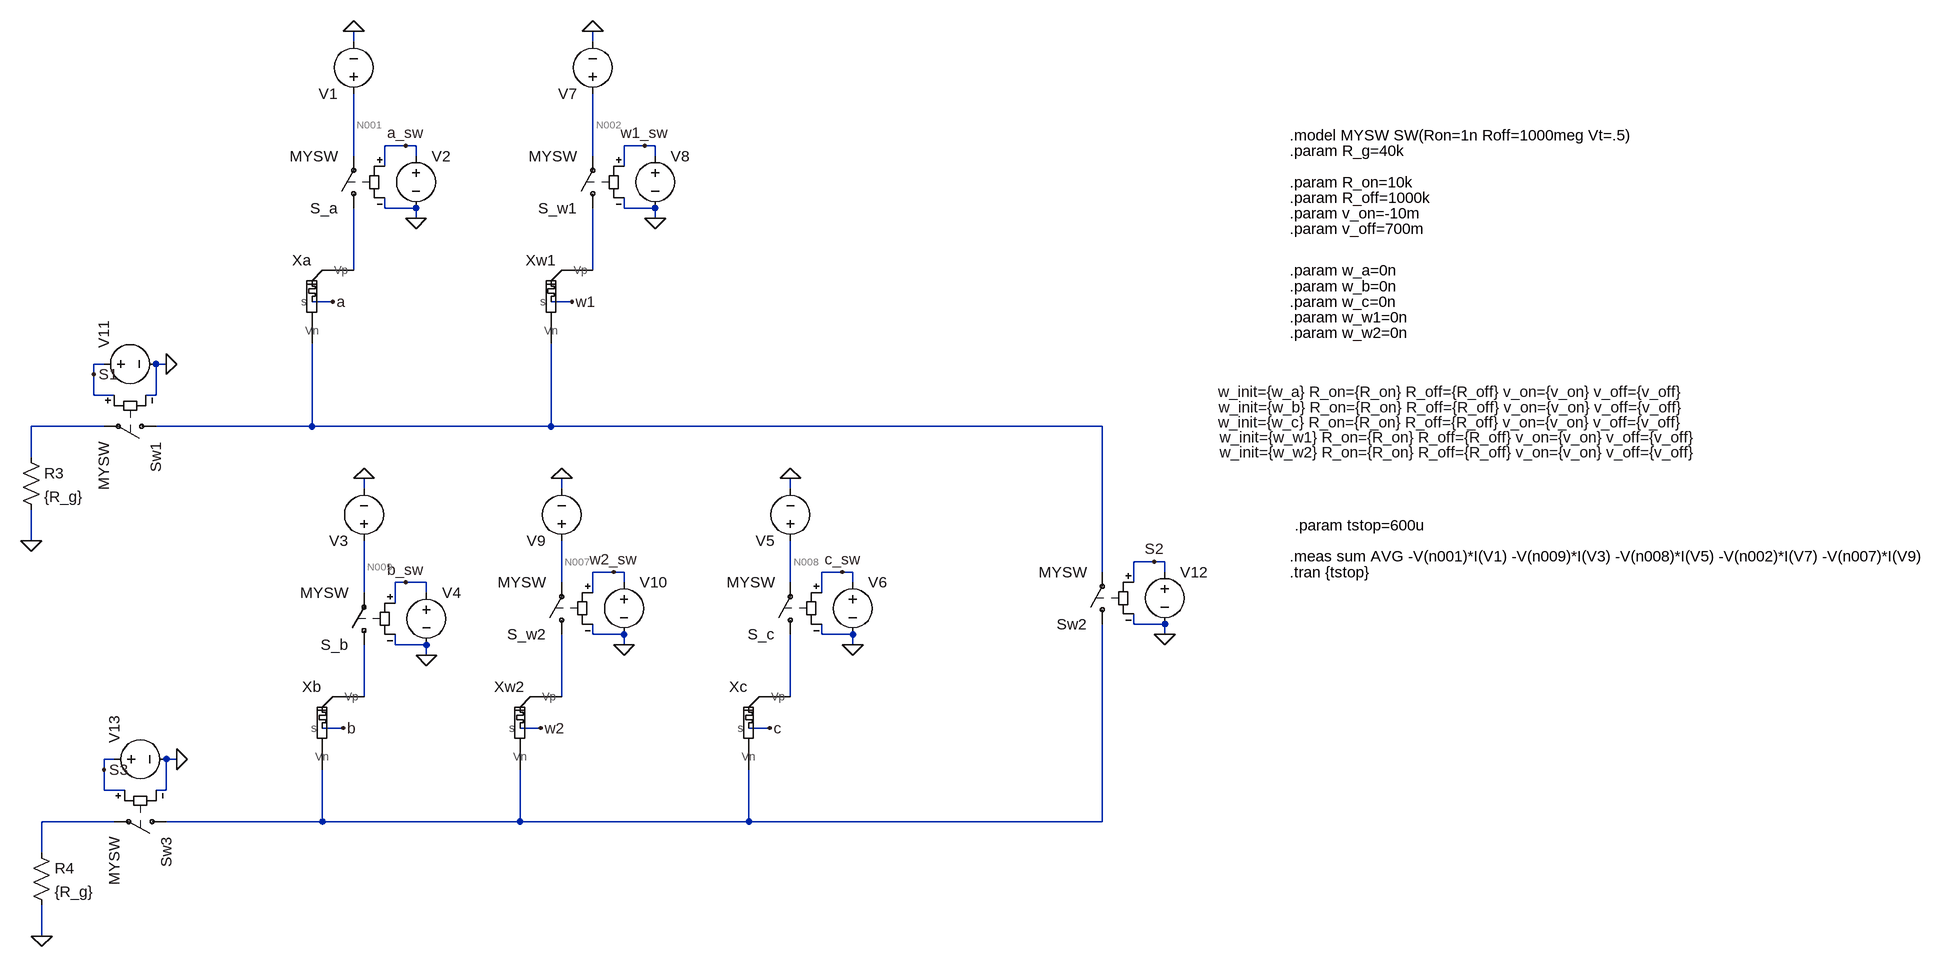
[diagram p0: schematic 1bit_adder_cin.asc]
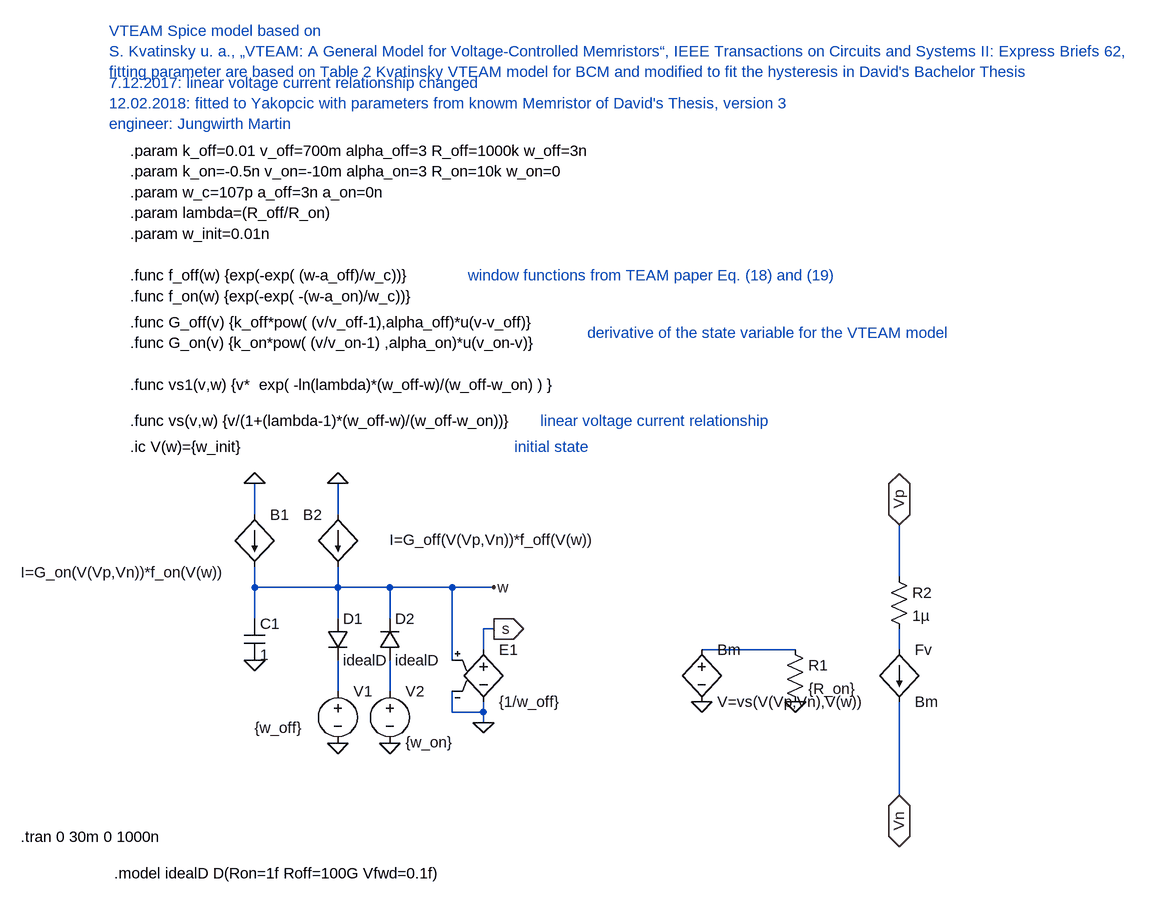
[diagram p1: sub-circuit vteam_knowm.asc]
1bit_adder_cin.asc, the LTspice schematic file:
Version 4
SHEET 1 2472 1840
WIRE -1360 144 -1360 128
WIRE -992 144 -992 128
WIRE -1280 304 -1312 304
WIRE -1264 304 -1280 304
WIRE -912 304 -944 304
WIRE -896 304 -912 304
WIRE -1360 320 -1360 224
WIRE -1264 320 -1264 304
WIRE -992 320 -992 224
WIRE -896 320 -896 304
WIRE -1312 336 -1312 304
WIRE -944 336 -944 304
WIRE -1312 400 -1312 384
WIRE -1264 400 -1312 400
WIRE -944 400 -944 384
WIRE -896 400 -944 400
WIRE -1264 416 -1264 400
WIRE -896 416 -896 400
WIRE -1360 496 -1360 400
WIRE -992 496 -992 400
WIRE -1392 544 -1424 544
WIRE -1024 544 -1056 544
WIRE -1744 640 -1760 640
WIRE -1648 640 -1664 640
WIRE -1760 656 -1760 640
WIRE -1760 688 -1760 656
WIRE -1728 688 -1760 688
WIRE -1664 688 -1664 640
WIRE -1664 688 -1680 688
WIRE -1744 736 -1856 736
WIRE -1424 736 -1424 608
WIRE -1424 736 -1664 736
WIRE -1056 736 -1056 608
WIRE -1056 736 -1424 736
WIRE -208 736 -1056 736
WIRE -1856 784 -1856 736
WIRE -1344 832 -1344 816
WIRE -1040 832 -1040 816
WIRE -688 832 -688 816
WIRE -1856 912 -1856 864
WIRE -128 944 -160 944
WIRE -112 944 -128 944
WIRE -960 960 -992 960
WIRE -944 960 -960 960
WIRE -608 960 -640 960
WIRE -592 960 -608 960
WIRE -208 960 -208 736
WIRE -112 960 -112 944
WIRE -1280 976 -1296 976
WIRE -1248 976 -1280 976
WIRE -1040 976 -1040 912
WIRE -944 976 -944 960
WIRE -688 976 -688 912
WIRE -592 976 -592 960
WIRE -160 976 -160 944
WIRE -1344 992 -1344 912
WIRE -1248 992 -1248 976
WIRE -992 992 -992 960
WIRE -640 992 -640 960
WIRE -1296 1008 -1296 976
WIRE -160 1040 -160 1024
WIRE -112 1040 -160 1040
WIRE -992 1056 -992 1040
WIRE -944 1056 -992 1056
WIRE -640 1056 -640 1040
WIRE -592 1056 -640 1056
WIRE -112 1056 -112 1040
WIRE -1296 1072 -1296 1056
WIRE -1248 1072 -1296 1072
WIRE -944 1072 -944 1056
WIRE -592 1072 -592 1056
WIRE -1248 1088 -1248 1072
WIRE -1344 1152 -1344 1072
WIRE -1040 1152 -1040 1056
WIRE -688 1152 -688 1056
WIRE -1376 1200 -1408 1200
WIRE -1072 1200 -1104 1200
WIRE -720 1200 -752 1200
WIRE -1728 1248 -1744 1248
WIRE -1632 1248 -1648 1248
WIRE -1744 1264 -1744 1248
WIRE -1744 1296 -1744 1264
WIRE -1712 1296 -1744 1296
WIRE -1648 1296 -1648 1248
WIRE -1648 1296 -1664 1296
WIRE -1728 1344 -1840 1344
WIRE -1408 1344 -1408 1264
WIRE -1408 1344 -1648 1344
WIRE -1104 1344 -1104 1264
WIRE -1104 1344 -1408 1344
WIRE -752 1344 -752 1264
WIRE -752 1344 -1104 1344
WIRE -208 1344 -208 1040
WIRE -208 1344 -752 1344
WIRE -1840 1392 -1840 1344
WIRE -1840 1520 -1840 1472
FLAG -1360 128 0
FLAG -1344 816 0
FLAG -1264 416 0
FLAG -1248 1088 0
FLAG -1392 544 a
FLAG -1376 1200 b
FLAG -1280 304 a_sw
FLAG -1280 976 b_sw
FLAG -1856 912 0
FLAG -1840 1520 0
FLAG -1648 640 0
FLAG -1760 656 S1
FLAG -1632 1248 0
FLAG -1744 1264 S3
FLAG -112 1056 0
FLAG -128 944 S2
FLAG -992 128 0
FLAG -896 416 0
FLAG -1024 544 w1
FLAG -912 304 w1_sw
FLAG -1040 816 0
FLAG -944 1072 0
FLAG -1072 1200 w2
FLAG -960 960 w2_sw
FLAG -688 816 0
FLAG -592 1072 0
FLAG -720 1200 c
FLAG -608 960 c_sw
SYMBOL voltage -1360 240 R180
WINDOW 3 24 96 Invisible 2
WINDOW 123 0 0 Left 2
WINDOW 39 0 0 Left 2
SYMATTR Value PWL file=a.csv
SYMATTR InstName V1
SYMBOL voltage -1344 928 R180
WINDOW 3 24 96 Invisible 2
WINDOW 123 0 0 Left 2
WINDOW 39 0 0 Left 2
SYMATTR Value PWL file=b.csv
SYMATTR InstName V3
SYMBOL sw -1360 416 R180
SYMATTR InstName S_a
SYMATTR Value MYSW
SYMBOL voltage -1264 304 R0
WINDOW 3 24 96 Invisible 2
WINDOW 123 0 0 Left 2
WINDOW 39 0 0 Left 2
SYMATTR Value PWL file=a_sw.csv
SYMATTR InstName V2
SYMBOL sw -1344 1088 R180
SYMATTR InstName S_b
SYMATTR Value MYSW
SYMBOL voltage -1248 976 R0
WINDOW 3 24 96 Invisible 2
WINDOW 123 0 0 Left 2
WINDOW 39 0 0 Left 2
SYMATTR Value PWL file=b_sw.csv
SYMATTR InstName V4
SYMBOL VTEAM_knowm -1472 496 R0
WINDOW 39 1806 202 Bottom 2
SYMATTR SpiceLine w_init={w_a} R_on={R_on} R_off={R_off} v_on={v_on} v_off={v_off}
SYMATTR InstName Xa
SYMBOL VTEAM_knowm -1456 1152 R0
WINDOW 39 1791 -430 Bottom 2
SYMATTR SpiceLine w_init={w_b} R_on={R_on} R_off={R_off} v_on={v_on} v_off={v_off}
SYMATTR InstName Xb
SYMBOL res -1872 768 R0
SYMATTR InstName R3
SYMATTR Value {R_g}
SYMBOL res -1856 1376 R0
SYMATTR InstName R4
SYMATTR Value {R_g}
SYMBOL sw -1648 736 R90
SYMATTR InstName Sw1
SYMATTR Value MYSW
SYMBOL voltage -1760 640 R270
WINDOW 3 24 96 Invisible 2
WINDOW 123 0 0 Left 2
WINDOW 39 0 0 Left 2
SYMATTR Value PWL file=S1.csv
SYMATTR InstName V11
SYMBOL sw -1632 1344 R90
SYMATTR InstName Sw3
SYMATTR Value MYSW
SYMBOL voltage -1744 1248 R270
WINDOW 3 24 96 Invisible 2
WINDOW 123 0 0 Left 2
WINDOW 39 0 0 Left 2
SYMATTR Value PWL file=S3.csv
SYMATTR InstName V13
SYMBOL sw -208 1056 R180
SYMATTR InstName Sw2
SYMATTR Value MYSW
SYMBOL voltage -112 944 R0
WINDOW 3 24 96 Invisible 2
WINDOW 123 0 0 Left 2
WINDOW 39 0 0 Left 2
SYMATTR Value PWL file=S2.csv
SYMATTR InstName V12
SYMBOL voltage -992 240 R180
WINDOW 3 24 96 Invisible 2
WINDOW 123 0 0 Left 2
WINDOW 39 0 0 Left 2
SYMATTR Value PWL file=w1.csv
SYMATTR InstName V7
SYMBOL sw -992 416 R180
SYMATTR InstName S_w1
SYMATTR Value MYSW
SYMBOL voltage -896 304 R0
WINDOW 3 24 96 Invisible 2
WINDOW 123 0 0 Left 2
WINDOW 39 0 0 Left 2
SYMATTR Value PWL file=w1_sw.csv
SYMATTR InstName V8
SYMBOL VTEAM_knowm -1104 496 R0
WINDOW 39 1449 272 Bottom 2
SYMATTR SpiceLine w_init={w_w1} R_on={R_on} R_off={R_off} v_on={v_on} v_off={v_off}
SYMATTR InstName Xw1
SYMBOL voltage -1040 928 R180
WINDOW 3 24 96 Invisible 2
WINDOW 123 0 0 Left 2
WINDOW 39 0 0 Left 2
SYMATTR Value PWL file=w2.csv
SYMATTR InstName V9
SYMBOL sw -1040 1072 R180
SYMATTR InstName S_w2
SYMATTR Value MYSW
SYMBOL voltage -944 960 R0
WINDOW 3 24 96 Invisible 2
WINDOW 123 0 0 Left 2
WINDOW 39 0 0 Left 2
SYMATTR Value PWL file=w2_sw.csv
SYMATTR InstName V10
SYMBOL VTEAM_knowm -1152 1152 R0
WINDOW 39 1497 -361 Bottom 2
SYMATTR SpiceLine w_init={w_w2} R_on={R_on} R_off={R_off} v_on={v_on} v_off={v_off}
SYMATTR InstName Xw2
SYMBOL voltage -688 928 R180
WINDOW 3 24 96 Invisible 2
WINDOW 123 0 0 Left 2
WINDOW 39 0 0 Left 2
SYMATTR Value PWL file=c.csv
SYMATTR InstName V5
SYMBOL sw -688 1072 R180
SYMATTR InstName S_c
SYMATTR Value MYSW
SYMBOL voltage -592 960 R0
WINDOW 3 24 96 Invisible 2
WINDOW 123 0 0 Left 2
WINDOW 39 0 0 Left 2
SYMATTR Value PWL file=c_sw.csv
SYMATTR InstName V6
SYMBOL VTEAM_knowm -800 1152 R0
WINDOW 39 1133 -407 Bottom 2
SYMATTR SpiceLine w_init={w_c} R_on={R_on} R_off={R_off} v_on={v_on} v_off={v_off}
SYMATTR InstName Xc
TEXT 80 288 Left 2 !.model MYSW SW(Ron=1n Roff=1000meg Vt=.5)
TEXT 80 312 Left 2 !.param R_g=40k
TEXT 80 960 Left 2 !.tran {tstop}
TEXT 80 496 Left 2 !.param w_a=0n
TEXT 80 520 Left 2 !.param w_b=0n
TEXT 80 544 Left 2 !.param w_c=0n
TEXT 80 568 Left 2 !.param w_w1=0n
TEXT 80 592 Left 2 !.param w_w2=0n
TEXT 80 360 Left 2 !.param R_on=10k
TEXT 80 384 Left 2 !.param R_off=1000k
TEXT 80 936 Left 2 !.meas sum AVG -V(n001)*I(V1) -V(n009)*I(V3) -V(n008)*I(V5) -V(n002)*I(V7) -V(n007)*I(V9)
TEXT 88 888 Left 2 !.param tstop=600u
TEXT 80 408 Left 2 !.param v_on=-10m
TEXT 80 432 Left 2 !.param v_off=700m

vteam_knowm.asc, the sub-circuit schematic file:
Version 4
SHEET 1 2456 1664
WIRE 208 576 208 528
WIRE 336 576 336 528
WIRE 1200 672 1200 592
WIRE 208 688 208 656
WIRE 336 688 336 656
WIRE 336 688 208 688
WIRE 416 688 336 688
WIRE 512 688 416 688
WIRE 576 688 512 688
WIRE 208 736 208 688
WIRE 336 736 336 688
WIRE 416 736 416 688
WIRE 576 752 560 752
WIRE 560 784 560 752
WIRE 1040 784 896 784
WIRE 1200 784 1200 752
WIRE 512 800 512 688
WIRE 336 848 336 800
WIRE 416 848 416 800
WIRE 512 880 512 848
WIRE 560 880 560 864
WIRE 560 880 512 880
WIRE 560 896 560 880
WIRE 1200 1008 1200 864
FLAG 208 528 0
FLAG 336 528 0
FLAG 208 800 0
FLAG 336 928 0
FLAG 416 928 0
FLAG 576 688 w
FLAG 896 864 0
FLAG 1040 864 0
FLAG 1200 592 Vp
IOPIN 1200 592 BiDir
FLAG 1200 1008 Vn
IOPIN 1200 1008 BiDir
FLAG 560 896 0
FLAG 576 752 s
IOPIN 576 752 Out
SYMBOL bi 208 576 R0
WINDOW 3 -360 89 Left 2
SYMATTR Value I=G_on(V(Vp,Vn))*f_on(V(w))
SYMATTR InstName B1
SYMBOL bi 336 576 M0
WINDOW 3 -396 39 Left 2
SYMATTR Value I=G_off(V(Vp,Vn))*f_off(V(w))
SYMATTR InstName B2
SYMBOL cap 192 736 R0
SYMATTR InstName C1
SYMATTR Value 1
SYMBOL diode 320 736 R0
SYMATTR InstName D1
SYMATTR Value idealD
SYMBOL diode 400 800 M180
WINDOW 0 24 64 Left 2
WINDOW 3 24 0 Left 2
SYMATTR InstName D2
SYMATTR Value idealD
SYMBOL voltage 336 832 R0
WINDOW 123 0 0 Left 2
WINDOW 39 0 0 Left 2
WINDOW 3 -128 72 Left 2
SYMATTR Value {w_off}
SYMATTR InstName V1
SYMBOL voltage 416 832 R0
WINDOW 3 24 94 Left 2
WINDOW 123 0 0 Left 2
WINDOW 39 0 0 Left 2
SYMATTR Value {w_on}
SYMATTR InstName V2
SYMBOL res 1024 768 R0
SYMATTR InstName R1
SYMATTR Value {R_on}
SYMBOL f 1200 784 R0
SYMATTR InstName Fv
SYMATTR Value Bm
SYMATTR Value2 -1
SYMBOL bv 896 768 R0
SYMATTR InstName Bm
SYMATTR Value V=vs(V(Vp,Vn),V(w))
SYMBOL e 560 768 R0
SYMATTR InstName E1
SYMATTR Value {1/w_off}
SYMBOL res 1184 656 R0
SYMATTR InstName R2
SYMATTR Value 1µ
TEXT 16 16 Left 2 !.param k_off=0.01 v_off=700m alpha_off=3 R_off=1000k w_off=3n
TEXT 16 48 Left 2 !.param k_on=-0.5n v_on=-10m alpha_on=3 R_on=10k w_on=0
TEXT 16 80 Left 2 !.param w_c=107p a_off=3n a_on=0n
TEXT 16 208 Left 2 !.func f_off(w) {exp(-exp( (w-a_off)/w_c))}
TEXT 16 240 Left 2 !.func f_on(w) {exp(-exp( -(w-a_on)/w_c))}
TEXT 16 280 Left 2 !.func G_off(v) {k_off*pow( (v/v_off-1),alpha_off)*u(v-v_off)}
TEXT 16 312 Left 2 !.func G_on(v) {k_on*pow( (v/v_on-1) ,alpha_on)*u(v_on-v)}
TEXT 16 432 Left 2 !.func vs(v,w) {v/(1+(lambda-1)*(w_off-w)/(w_off-w_on))}
TEXT -16 -168 Left 2 ;VTEAM Spice model based on \nS. Kvatinsky u. a., „VTEAM: A General Model for Voltage-Controlled Memristors“, IEEE Transactions on Circuits and Systems II: Express Briefs 62,\nfitting parameter are based on Table 2 Kvatinsky VTEAM model for BCM and modified to fit the hysteresis in David's Bachelor Thesis
TEXT 16 112 Left 2 !.param lambda=(R_off/R_on)
TEXT 16 472 Left 2 !.ic V(w)={w_init}
TEXT 536 208 Left 2 ;window functions from TEAM paper Eq. (18) and (19)
TEXT 720 296 Left 2 ;derivative of the state variable for the VTEAM model
TEXT 648 432 Left 2 ;linear voltage current relationship
TEXT 608 472 Left 2 ;initial state
TEXT -8 1128 Left 2 !.model idealD D(Ron=1f Roff=100G Vfwd=0.1f)
TEXT 16 144 Left 2 !.param w_init=0.01n
TEXT -16 -88 Left 2 ;7.12.2017: linear voltage current relationship changed\n12.02.2018: fitted to Yakopcic with parameters from knowm Memristor of David's Thesis, version 3\nengineer: Jungwirth Martin
TEXT -152 1072 Left 2 !.tran 0 30m 0 1000n
TEXT 16 376 Left 2 !.func vs1(v,w) {v*  exp( -ln(lambda)*(w_off-w)/(w_off-w_on) ) }

The netlist it stands for:
* 1bit_adder_cin.asc
V1 N001 0 PWL file=a.csv
V3 N009 0 PWL file=b.csv
S_a N003 N001 a_sw 0 MYSW
V2 a_sw 0 PWL file=a_sw.csv
S_b N010 N009 b_sw 0 MYSW
V4 b_sw 0 PWL file=b_sw.csv
XXa a N003 N006 vteam_knowm params: w_init={w_a} R_on={R_on} R_off={R_off} v_on={v_on} v_off={v_off}
XXb b N010 N014 vteam_knowm params: w_init={w_b} R_on={R_on} R_off={R_off} v_on={v_on} v_off={v_off}
R3 N005 0 {R_g}
R4 N013 0 {R_g}
Sw1 N006 N005 S1 0 MYSW
V11 S1 0 PWL file=S1.csv
Sw3 N014 N013 S3 0 MYSW
V13 S3 0 PWL file=S3.csv
Sw2 N014 N006 S2 0 MYSW
V12 S2 0 PWL file=S2.csv
V7 N002 0 PWL file=w1.csv
S_w1 N004 N002 w1_sw 0 MYSW
V8 w1_sw 0 PWL file=w1_sw.csv
XXw1 w1 N004 N006 vteam_knowm params: w_init={w_w1} R_on={R_on} R_off={R_off} v_on={v_on} v_off={v_off}
V9 N007 0 PWL file=w2.csv
S_w2 N011 N007 w2_sw 0 MYSW
V10 w2_sw 0 PWL file=w2_sw.csv
XXw2 w2 N011 N014 vteam_knowm params: w_init={w_w2} R_on={R_on} R_off={R_off} v_on={v_on} v_off={v_off}
V5 N008 0 PWL file=c.csv
S_c N012 N008 c_sw 0 MYSW
V6 c_sw 0 PWL file=c_sw.csv
XXc c N012 N014 vteam_knowm params: w_init={w_c} R_on={R_on} R_off={R_off} v_on={v_on} v_off={v_off}

* block symbol definitions
.subckt vteam_knowm s Vp Vn
B1 0 w I=G_on(V(Vp,Vn))*f_on(V(w))
B2 0 w I=G_off(V(Vp,Vn))*f_off(V(w))
C1 w 0 1
D1 w N003 idealD
D2 N004 w idealD
V1 N003 0 {w_off}
V2 N004 0 {w_on}
R1 N001 0 {R_on}
Fv N002 Vn Bm -1
Bm N001 0 V=vs(V(Vp,Vn),V(w))
E1 s 0 w 0 {1/w_off}
R2 Vp N002 1µ
.param k_off=0.01 v_off=700m alpha_off=3 R_off=1000k w_off=3n
.param k_on=-0.5n v_on=-10m alpha_on=3 R_on=10k w_on=0
.param w_c=107p a_off=3n a_on=0n
.func f_off(w) {exp(-exp( (w-a_off)/w_c))}
.func f_on(w) {exp(-exp( -(w-a_on)/w_c))}
.func G_off(v) {k_off*pow( (v/v_off-1),alpha_off)*u(v-v_off)}
.func G_on(v) {k_on*pow( (v/v_on-1) ,alpha_on)*u(v_on-v)}
.func vs(v,w) {v/(1+(lambda-1)*(w_off-w)/(w_off-w_on))}
* VTEAM Spice model based on
* S. Kvatinsky u. a., „VTEAM: A General Model for Voltage-Controlled Memristors“, IEEE Transactions on Circuits and Systems II: Express Briefs 62,
* fitting parameter are based on Table 2 Kvatinsky VTEAM model for BCM and modified to fit the hysteresis in David's Bachelor Thesis
.param lambda=(R_off/R_on)
.ic V(w)={w_init}
* window functions from TEAM paper Eq. (18) and (19)
* derivative of the state variable for the VTEAM model
* linear voltage current relationship
* initial state
.model idealD D(Ron=1f Roff=100G Vfwd=0.1f)
.param w_init=0.01n
* 7.12.2017: linear voltage current relationship changed
* 12.02.2018: fitted to Yakopcic with parameters from knowm Memristor of David's Thesis, version 3
* engineer: Jungwirth Martin
.tran 0 30m 0 1000n
.func vs1(v,w) {v*  exp( -ln(lambda)*(w_off-w)/(w_off-w_on) ) }
.ends vteam_knowm

.model D D
.lib standard.dio
.model MYSW SW(Ron=1n Roff=1000meg Vt=.5)
.param R_g=40k
.tran {tstop}
.param w_a=0n
.param w_b=0n
.param w_c=0n
.param w_w1=0n
.param w_w2=0n
.param R_on=10k
.param R_off=1000k
.meas sum AVG -V(n001)*I(V1) -V(n009)*I(V3) -V(n008)*I(V5) -V(n002)*I(V7) -V(n007)*I(V9)
.param tstop=600u
.param v_on=-10m
.param v_off=700m
.backanno
.end